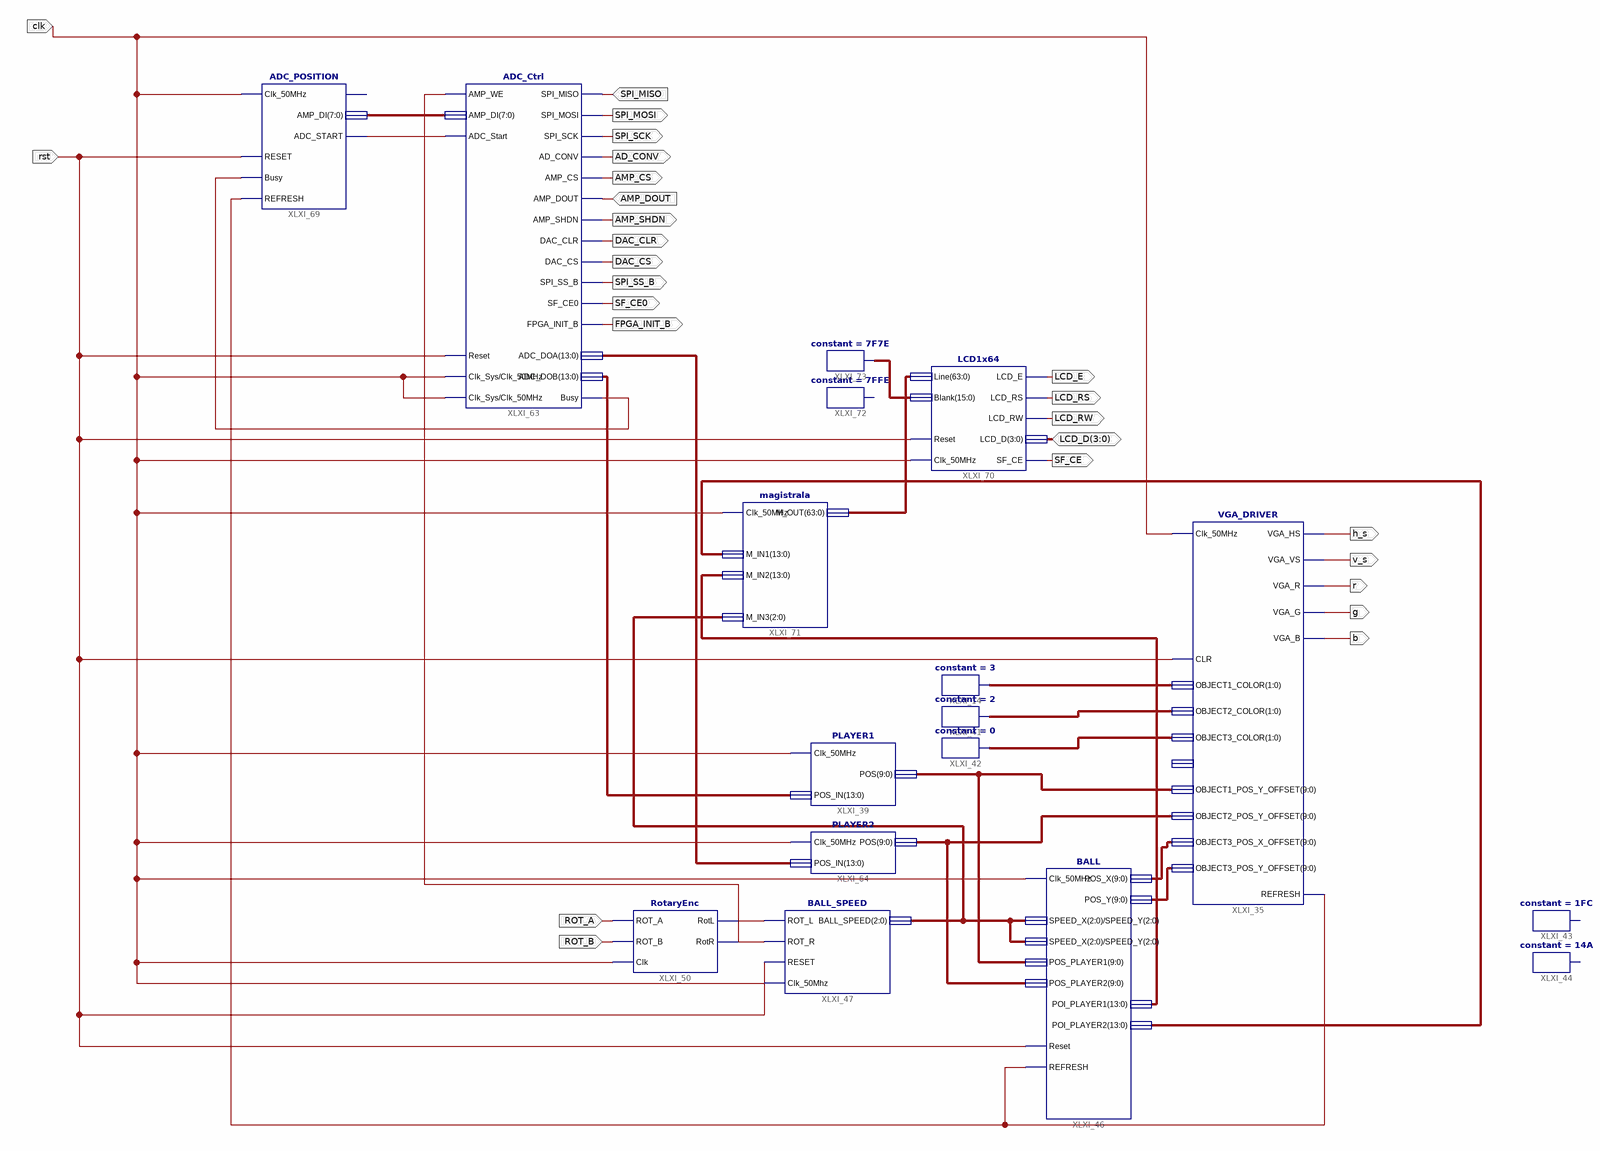
[diagram p0: schematic sheet 1]
// Xilinx ISE schematic scheme.sch (spartan3e) as structural Verilog: 17 symbols, 26 ports
module scheme (
  input  clk,
  input  rst,
  input  SPI_MISO,
  input  AMP_DOUT,
  input  ROT_A,
  input  ROT_B,
  inout  [3:0] LCD_D,
  output FPGA_INIT_B,
  output SF_CE0,
  output SPI_SS_B,
  output DAC_CS,
  output DAC_CLR,
  output AMP_SHDN,
  output AMP_CS,
  output AD_CONV,
  output SPI_SCK,
  output SPI_MOSI,
  output LCD_E,
  output LCD_RS,
  output LCD_RW,
  output SF_CE,
  output h_s,
  output r,
  output g,
  output b,
  output v_s
);

  wire XLXN_128, XLXN_251, XLXN_253, XLXN_331, XLXN_349;
  wire [1:0] XLXN_103, XLXN_104, XLXN_105;
  wire [2:0] XLXN_294;
  wire [7:0] XLXN_347;
  wire [9:0] XLXN_108, XLXN_109, XLXN_326, XLXN_327;
  wire [13:0] XLXN_298, XLXN_302, XLXN_312, XLXN_315;
  wire [15:0] XLXN_352;
  wire [63:0] XLXN_250;

  VGA_DRIVER XLXI_35 (
    .CLR(rst), .OBJECT1_COLOR(XLXN_103), .OBJECT2_COLOR(XLXN_104), .OBJECT3_COLOR(XLXN_105),
    .OBJECT1_POS_Y_OFFSET(XLXN_326), .OBJECT2_POS_Y_OFFSET(XLXN_327), .OBJECT3_POS_X_OFFSET(XLXN_108),
    .OBJECT3_POS_Y_OFFSET(XLXN_109), .REFRESH(XLXN_331), .Clk_50MHz(clk), .VGA_HS(h_s), .VGA_VS(v_s),
    .VGA_R(r), .VGA_G(g), .VGA_B(b));  // open: OBJECT4_COLOR
  PLAYER1 XLXI_39 (.Clk_50MHz(clk), .POS_IN(XLXN_298), .POS(XLXN_326));
  constant #(.CValue("3")) XLXI_14 (.O(XLXN_103));
  constant #(.CValue("2")) XLXI_41 (.O(XLXN_104));
  constant #(.CValue("0")) XLXI_42 (.O(XLXN_105));
  BALL XLXI_46 (
    .Clk_50MHz(clk), .Reset(rst), .POS_PLAYER1(XLXN_326), .POS_PLAYER2(XLXN_327), .SPEED_X(XLXN_294),
    .SPEED_Y(XLXN_294), .POI_PLAYER1(XLXN_315), .POI_PLAYER2(XLXN_312), .POS_X(XLXN_108), .POS_Y(XLXN_109),
    .REFRESH(XLXN_331));
  constant #(.CValue("1FC")) XLXI_43 ();  // open: O
  constant #(.CValue("14A")) XLXI_44 ();  // open: O
  BALL_SPEED XLXI_47 (.ROT_L(XLXN_128), .ROT_R(XLXN_253), .RESET(rst), .Clk_50Mhz(clk), .BALL_SPEED(XLXN_294));
  PLAYER2 XLXI_64 (.Clk_50MHz(clk), .POS_IN(XLXN_302), .POS(XLXN_327));
  ADC_Ctrl XLXI_63 (
    .Clk_Sys(clk), .AMP_WE(XLXN_253), .SPI_MISO(SPI_MISO), .AMP_DOUT(AMP_DOUT), .AMP_DI(XLXN_347),
    .Busy(XLXN_251), .SPI_MOSI(SPI_MOSI), .SPI_SCK(SPI_SCK), .AMP_CS(AMP_CS), .AMP_SHDN(AMP_SHDN),
    .AD_CONV(AD_CONV), .DAC_CS(DAC_CS), .DAC_CLR(DAC_CLR), .SPI_SS_B(SPI_SS_B), .SF_CE0(SF_CE0),
    .FPGA_INIT_B(FPGA_INIT_B), .ADC_DOA(XLXN_302), .ADC_DOB(XLXN_298), .Reset(rst), .Clk_50MHz(clk),
    .ADC_Start(XLXN_349));
  ADC_POSITION XLXI_69 (
    .Clk_50MHz(clk), .RESET(rst), .Busy(XLXN_251), .REFRESH(XLXN_331), .AMP_DI(XLXN_347), .ADC_START(XLXN_349));  // open: AMP_WE
  magistrala XLXI_71 (.Clk_50MHz(clk), .M_IN1(XLXN_312), .M_IN2(XLXN_315), .M_OUT(XLXN_250), .M_IN3(XLXN_294));
  LCD1x64 XLXI_70 (
    .Clk_50MHz(clk), .Reset(rst), .Line(XLXN_250), .Blank(XLXN_352), .LCD_D(LCD_D), .LCD_E(LCD_E),
    .LCD_RW(LCD_RW), .LCD_RS(LCD_RS), .SF_CE(SF_CE));
  RotaryEnc XLXI_50 (.ROT_A(ROT_A), .ROT_B(ROT_B), .RotL(XLXN_128), .RotR(XLXN_253), .Clk(clk));
  constant #(.CValue("7FFE")) XLXI_72 ();  // open: O
  constant #(.CValue("7F7E")) XLXI_73 (.O(XLXN_352));
endmodule
